# Altium project ST.PrjPcb
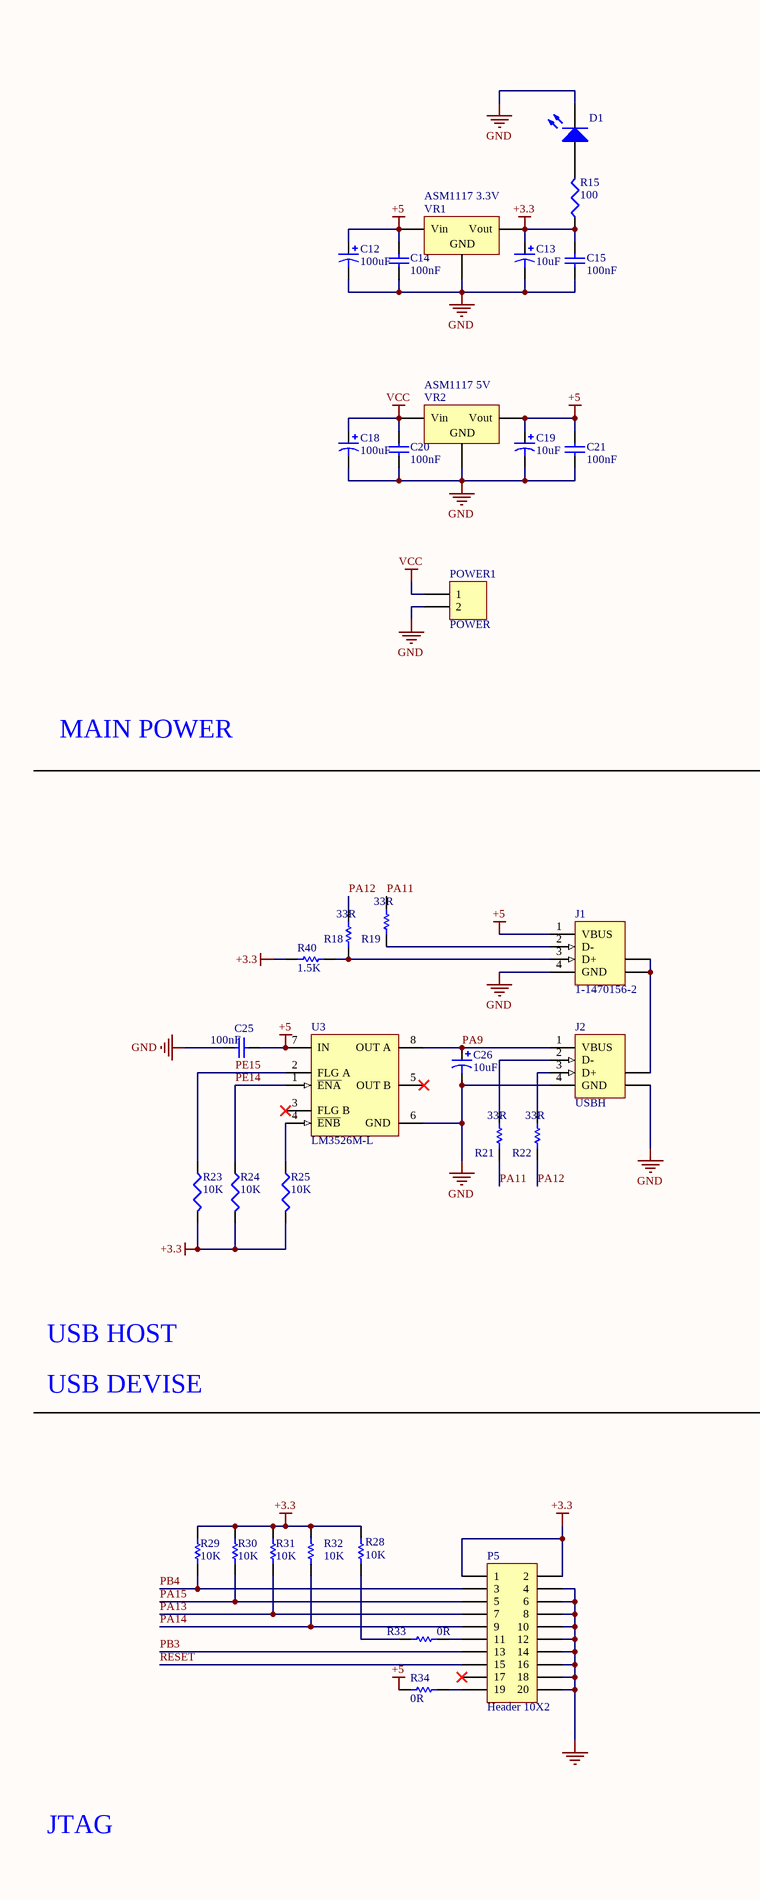
[diagram p0: mainBoard.SchDoc, left]
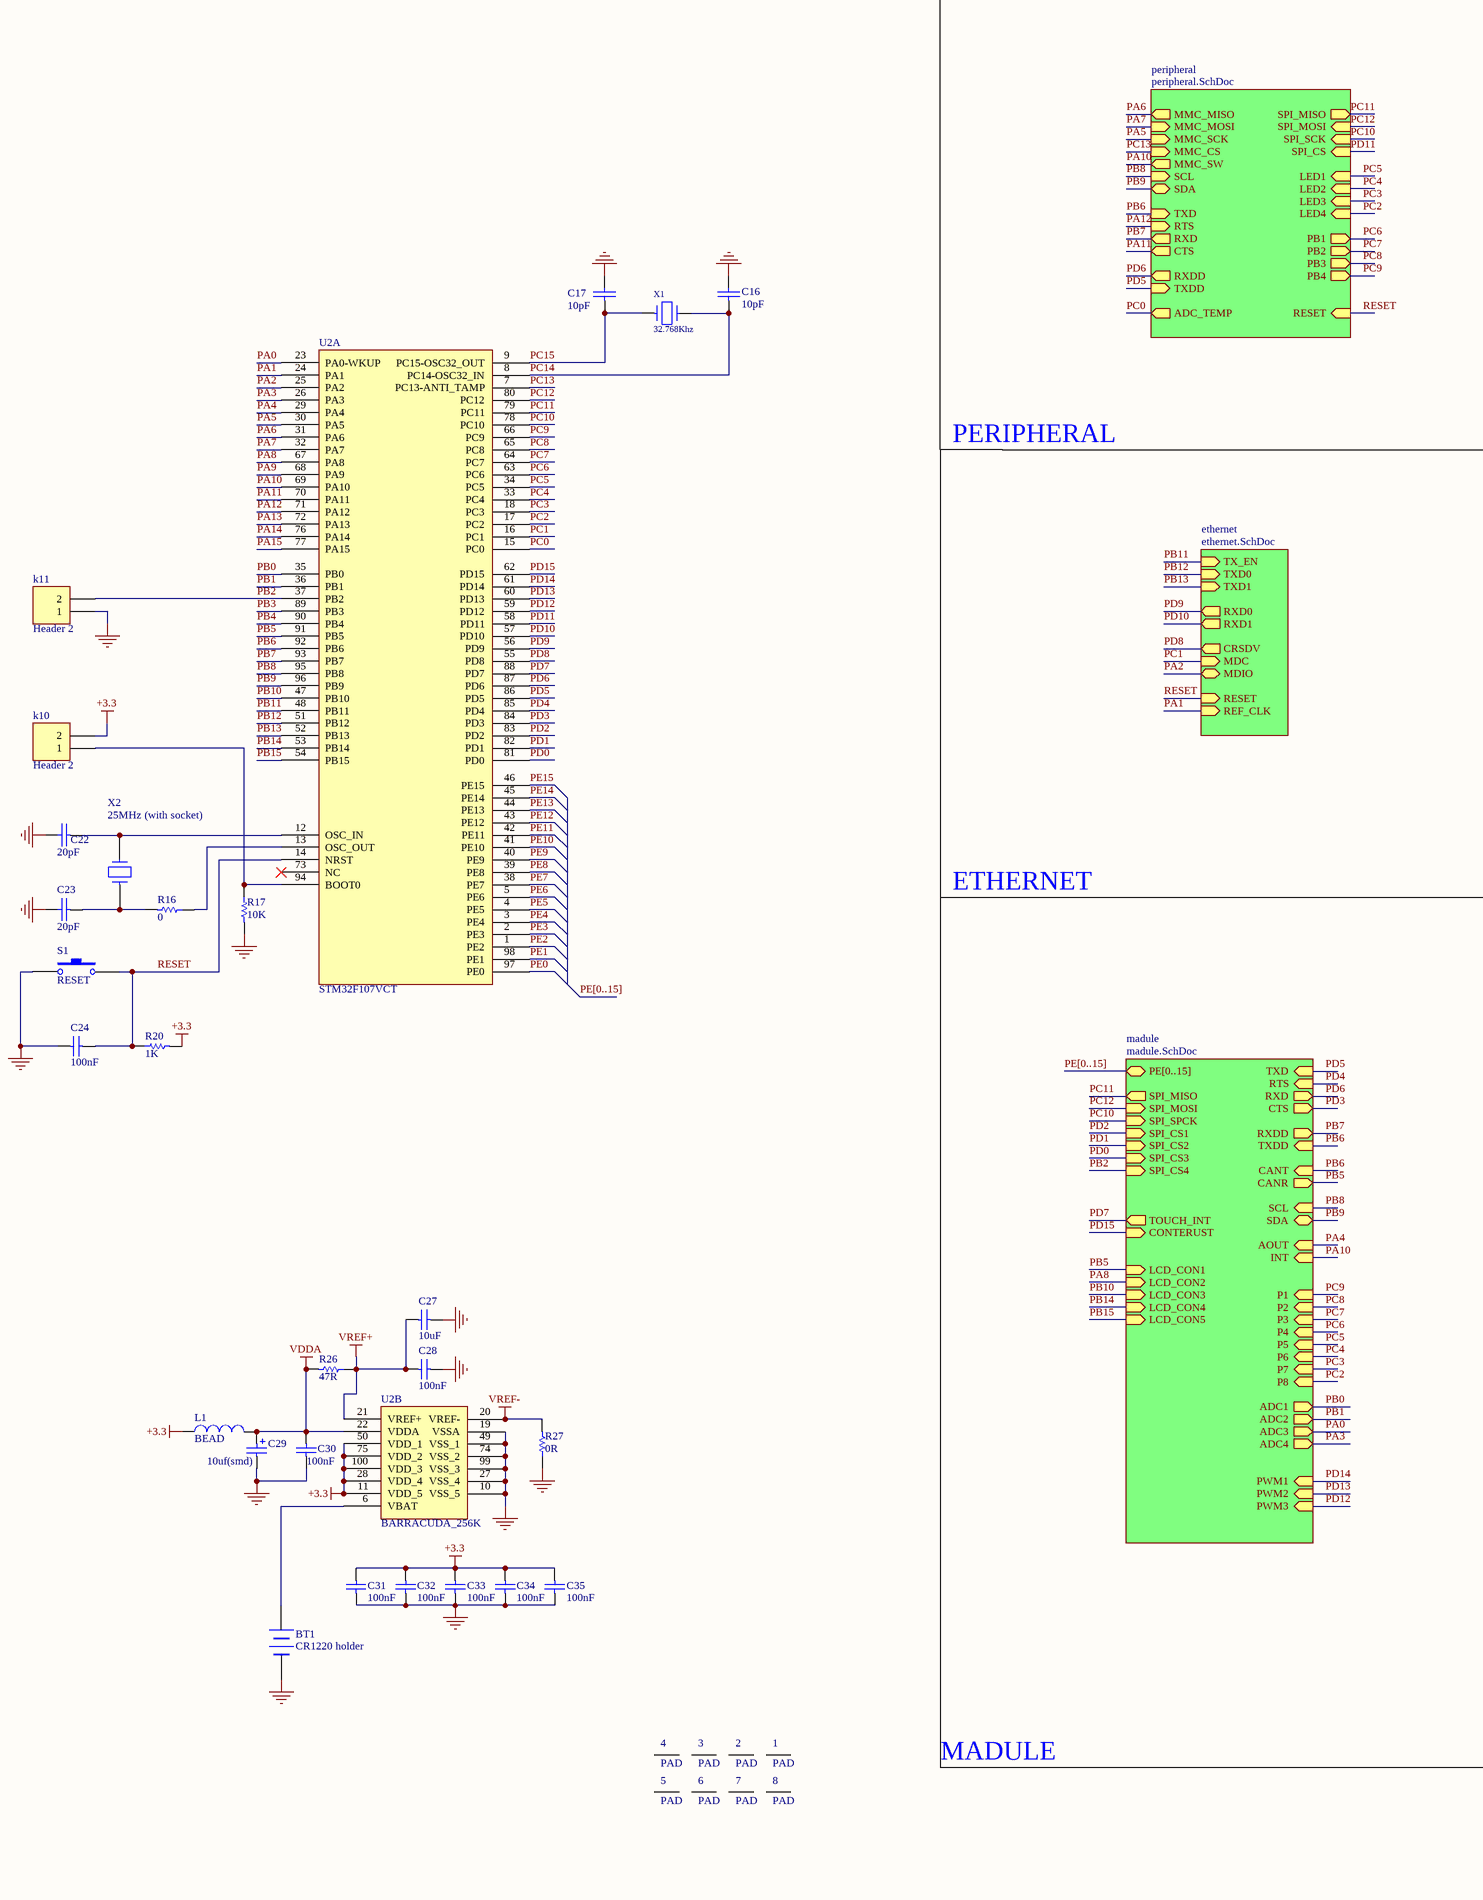
[diagram p1: mainBoard.SchDoc, right]
4 sheets, 143 parts. Net scope: hierarchical (ports join the sheet entries above them; power ports are global).
Board file: 94KA02-V1.PcbDoc
Sheets:
  mainBoard.SchDoc
    peripheral = peripheral.SchDoc
    ethernet = ethernet.SchDoc
    madule = madule.SchDoc

## Sheet mainBoard.SchDoc
size A2

### Parts
1  PAD  [pad]
2  PAD  [pad]
3  PAD  [pad]
4  PAD  [pad]
5  PAD  [pad]
6  PAD  [pad]
7  PAD  [pad]
8  PAD  [pad]
BT1  CR1220 holder  [BAT]
C12  100uf  [CAP470]
C13  10uf  [CAP10]
C14  100nF  [1206]
C15  100nF  [1206]
C16  10pF  [1206]
C17  10pF  [1206]
C18  100uf  [CAP470]
C19  10uf  [CAP10]
C20  100nF  [1206]
C21  100nF  [1206]
C22  20pF  [1206]
C23  20pF  [1206]
C24  100nF  [1206]
C25  100nF  [1206]
C26  10uf  [CAP10]
C27  10uF  [1206]
C28  100nF  [1206]
C29  10uf(smd)  [1206]
C30  100nF  [1206]
C31  100nF  [0805]
C32  100nF  [0805]
C33  100nF  [0805]
C34  100nF  [0805]
C35  100nF  [0805]
D1  LED0  [LED-0805]  (value not drawn)
J1  1-1470156-2  [440247]
J2  USBH  [787761]
k10  Header 2  [HDR1X2]
k11  Header 2  [HDR1X2]
L1  BEAD  [1206]
P5  Header 10X2  [IDC20S]
POWER1  POWER  [power jack]
R15  100  [1206]
R16  0  [1206]
R17  10K  [1206]
R18  33R  [1206]
R19  33R  [1206]
R20  1K  [1206]
R21  33R  [1206]
R22  33R  [1206]
R23  10K  [1206]
R24  10K  [1206]
R25  10K  [1206]
R26  47R  [1206]
R27  0R  [1206]
R28  10K  [1206]
R29  10K  [1206]
R30  10K  [1206]
R31  10K  [1206]
R32  10K  [1206]
R33  0R  [1206]
R34  0R  [1206]
R40  1.5K  [1206]
S1  RESET  [SWSMD]
U2  STM32F107VCT  [TQ100_TOOL]  (parts A,B of 2)
U3  LM3526M-L  [M08A_N]
VR1  ASM1117 3.3V  [Regolator]
VR2  ASM1117 5V  [Regolator]
X1  32.768Khz  [OSCILATOR]
X2  25MHz (with socket)  [XTAL3]

### Sub-sheets
ethernet = ethernet.SchDoc: TX_EN (in), TXD0 (in), TXD1 (in), RXD0 (out), RXD1 (out), CRSDV (out), MDC (in), MDIO (bidir), RESET (in), REF_CLK (in)
madule = madule.SchDoc: PE[0..15] (bidir), TXD (in), RTS (in), RXD (out), CTS (out), RXDD (out), TXDD (in), CANT (in), CANR (out), SCL (in), SDA (bidir), AOUT (in), INT (in), SPI_MOSI (in), SPI_MISO (out), SPI_SPCK (in), SPI_CS1 (in), SPI_CS2 (in), SPI_CS3 (in), SPI_CS4 (in), P1 (in), P2 (in), P3 (in), P4 (in), P5 (in), P6 (in), P7 (in), P8 (in), ADC1 (out), ADC2 (out), ADC3 (out), ADC4 (out), PWM1 (in), PWM2 (in), PWM3 (in), TOUCH_INT (out), CONTERUST (in), LCD_CON1 (in), LCD_CON2 (in), LCD_CON3 (in), LCD_CON4 (in), LCD_CON5 (in)
peripheral = peripheral.SchDoc: MMC_MISO (out), MMC_MOSI (in), MMC_SCK (in), MMC_CS (in), SCL (in), SDA (bidir), TXD (in), RTS (in), RXD (out), CTS (out), RXDD (out), TXDD (in), SPI_MISO (out), SPI_MOSI (in), SPI_SCK (in), SPI_CS (in), LED1 (in), LED2 (in), LED3 (in), LED4 (in), PB1 (out), PB2 (out), PB3 (out), PB4 (out), RESET (in), ADC_TEMP (out), MMC_SW (out)

### Nets
+3.3: C13.1 C15.1 C31.1 C32.1 C33.1 C34.1 C35.1 k10.2 L1.1 P5.1 P5.2 R15.1 R20.2 R23.2 R24.2 R25.2 R28.2 R29.2 R30.2 R31.2 R32.2 R40.1 U2.11(VDD_5) U2.28(VDD_4) U2.50(VDD_1) U2.75(VDD_2) U2.100(VDD_3) VR1.4(Vout)
+5: C12.1 C14.1 C19.1 C21.1 C25.1 J1.1(VBUS) R34.2 U3.7(IN) VR1.3(Vin) VR2.4(Vout)
GND: BT1.2(-) C12.2 C13.2 C14.2 C15.2 C16.2 C17.2 C18.2 C19.2 C20.2 C21.2 C22.2 C23.2 C24.1 C25.2 C26.2 C27.2 C28.2 C29.2 C30.2 C31.2 C32.2 C33.2 C34.2 C35.2 D1.2(K) J1.4(GND) J2.4(GND) J2.6(SHLD) k11.1 P5.4 P5.6 P5.8 P5.10 P5.12 P5.14 P5.16 P5.18 P5.20 POWER1.2 R17.2 R27.1 S1.1 U2.10(VSS_5) U2.19(VSSA) U2.27(VSS_4) U2.49(VSS_1) U2.74(VSS_2) U2.99(VSS_3) U3.6(GND) VR1.1(GND) VR2.1(GND)
VCC: C18.1 C20.1 POWER1.1 VR2.3(Vin)
VDDA: C29.1 C30.1 L1.2 R26.2 U2.22(VDDA)
VREF+: C27.1 C28.1 R26.1 U2.21(VREF+)
VREF-: R27.2 U2.20(VREF-)
PA0: U2.23(PA0-WKUP) ; sheet madule/ADC3
PA1: U2.24(PA1) ; sheet ethernet/REF_CLK  [project net 50 MHZ]
PA2: U2.25(PA2) ; sheet ethernet/MDIO
PA3: U2.26(PA3) ; sheet madule/ADC4
PA4: U2.29(PA4) ; sheet madule/AOUT
PA5: U2.30(PA5) ; sheet peripheral/MMC_SCK
PA6: U2.31(PA6) ; sheet peripheral/MMC_MISO
PA7: U2.32(PA7) ; sheet peripheral/MMC_MOSI
PA8: U2.67(PA8) ; sheet madule/LCD_CON2
PA9: C26.1 J2.1(VBUS) U2.68(PA9) U3.8(OUT_A)
PA10: U2.69(PA10) ; sheet peripheral/MMC_SW, sheet madule/INT
PA11: R19.1 R21.2 U2.70(PA11) ; sheet peripheral/CTS
PA12: R18.1 R22.2 U2.71(PA12) ; sheet peripheral/RTS
PA13: P5.7 R31.1 U2.72(PA13)
PA14: P5.9 R32.1 U2.76(PA14)
PA15: P5.5 R30.1 U2.77(PA15)
PB0: U2.35(PB0) ; sheet madule/ADC1
PB1: U2.36(PB1) ; sheet madule/ADC2
PB2: k11.2 U2.37(PB2) ; sheet madule/SPI_CS4
PB3: P5.13 U2.89(PB3)
PB4: P5.3 R29.1 U2.90(PB4)
PB5: U2.91(PB5) ; sheet madule/CANR, sheet madule/LCD_CON1
PB6: U2.92(PB6) ; sheet peripheral/TXD, sheet madule/TXDD, sheet madule/CANT
PB7: U2.93(PB7) ; sheet peripheral/RXD, sheet madule/RXDD
PB8: U2.95(PB8) ; sheet peripheral/SCL, sheet madule/SCL
PB9: U2.96(PB9) ; sheet peripheral/SDA, sheet madule/SDA
PB10: U2.47(PB10) ; sheet madule/LCD_CON3
PB11: U2.48(PB11) ; sheet ethernet/TX_EN
PB12: U2.51(PB12) ; sheet ethernet/TXD0
PB13: U2.52(PB13) ; sheet ethernet/TXD1
PB14: U2.53(PB14) ; sheet madule/LCD_CON4
PB15: U2.54(PB15) ; sheet madule/LCD_CON5
PC0: U2.15(PC0) ; sheet peripheral/ADC_TEMP
PC1: U2.16(PC1) ; sheet ethernet/MDC
PC2: U2.17(PC2) ; sheet peripheral/LED4, sheet madule/P8
PC3: U2.18(PC3) ; sheet peripheral/LED3, sheet madule/P7
PC4: U2.33(PC4) ; sheet peripheral/LED2, sheet madule/P6
PC5: U2.34(PC5) ; sheet peripheral/LED1, sheet madule/P5
PC6: U2.63(PC6) ; sheet peripheral/PB1, sheet madule/P4
PC7: U2.64(PC7) ; sheet peripheral/PB2, sheet madule/P3
PC8: U2.65(PC8) ; sheet peripheral/PB3, sheet madule/P2
PC9: U2.66(PC9) ; sheet peripheral/PB4, sheet madule/P1
PC10: U2.78(PC10) ; sheet peripheral/SPI_SCK, sheet madule/SPI_SPCK
PC11: U2.79(PC11) ; sheet peripheral/SPI_MISO, sheet madule/SPI_MISO
PC12: U2.80(PC12) ; sheet peripheral/SPI_MOSI, sheet madule/SPI_MOSI
PC13: U2.7(PC13-ANTI_TAMP) ; sheet peripheral/MMC_CS
PC14: C16.1 U2.8(PC14-OSC32_IN) X1.2
PC15: C17.1 U2.9(PC15-OSC32_OUT) X1.1
PD0: U2.81(PD0) ; sheet madule/SPI_CS3
PD1: U2.82(PD1) ; sheet madule/SPI_CS2
PD2: U2.83(PD2) ; sheet madule/SPI_CS1
PD3: U2.84(PD3) ; sheet madule/CTS
PD4: U2.85(PD4) ; sheet madule/RTS
PD5: U2.86(PD5) ; sheet peripheral/TXDD, sheet madule/TXD
PD6: U2.87(PD6) ; sheet peripheral/RXDD, sheet madule/RXD
PD7: U2.88(PD7) ; sheet madule/TOUCH_INT
PD8: U2.55(PD8) ; sheet ethernet/CRSDV
PD9: U2.56(PD9) ; sheet ethernet/RXD0
PD10: U2.57(PD10) ; sheet ethernet/RXD1
PD11: U2.58(PD11) ; sheet peripheral/SPI_CS
PD12: U2.59(PD12) ; sheet madule/PWM3
PD13: U2.60(PD13) ; sheet madule/PWM2
PD14: U2.61(PD14) ; sheet madule/PWM1
PD15: U2.62(PD15) ; sheet madule/CONTERUST
PE0: U2.97(PE0)
PE1: U2.98(PE1)
PE2: U2.1(PE2)
PE3: U2.2(PE3)
PE4: U2.3(PE4)
PE5: U2.4(PE5)
PE6: U2.5(PE6)
PE7: U2.38(PE7)
PE8: U2.39(PE8)
PE9: U2.40(PE9)
PE10: U2.41(PE10)
PE11: U2.42(PE11)
PE12: U2.43(PE12)
PE13: U2.44(PE13)
PE14: R24.1 U2.45(PE14) U3.1(~{ENA})
PE15: R23.1 U2.46(PE15) U3.2(FLG_A)
RESET: C24.2 P5.15 R20.1 S1.2 U2.14(NRST) ; sheet peripheral/RESET, sheet ethernet/RESET
NetBT1_1: BT1.1(+) U2.6(VBAT)
NetC22_1: C22.1 U2.12(OSC_IN) X2.2
NetC23_1: C23.1 R16.2 X2.1
NetD1_1: D1.1(A) R15.2
NetJ1_2: J1.2(D-) R19.2
NetJ1_3: J1.3(D+) R18.2 R40.2
NetJ1_5: J1.5(SHLD) J1.6(SHLD) J2.5(SHLD)
NetJ2_2: J2.2(D-) R21.1
NetJ2_3: J2.3(D+) R22.1
Netk10_1: k10.1 R17.1 U2.94(BOOT0)
NetP5_11: P5.11 R33.1
NetP5_19: P5.19 R34.1
NetR16_1: R16.1 U2.13(OSC_OUT)
NetR25_1: R25.1 U3.4(~{ENB})
NetR28_1: R28.1 R33.2

Not connected (* = marked no-connect by the designer): 1 1; 2 1; 3 1; 4 1; 5 1; 6 1; 7 1; 8 1; P5 17*; U2 73(NC)*; U3 3(FLG_B)* 5(OUT_B)*

### Buses and harness runs
bus PE[0..15]
bus PE[0..15] = sheet madule/PE[0..15]

### Notes on the sheet
- PERIPHERAL
- MAIN POWER
- ETHERNET
- USB HOST
- USB DEVISE
- MADULE
- JTAG

### Library data of the parts
BT1 = BATTERY
C12 C13 C18 C19 C26 C29 = Cap Pol1: Polarized Capacitor (Radial); Published: 8-Jun-2000; Publisher: Altium Limited
  C12 C18: LatestRevisionDate: 17-Jul-2002; LatestRevisionNote: Re-released for DXP Platform.; PackageReference: RB7.6-15; Value: 100uF
  C13 C19 C26: LatestRevisionDate: 17-Jul-2002; LatestRevisionNote: Re-released for DXP Platform.; PackageReference: RB7.6-15; Value: 10uF
  C29: Revision: July-2002: Re-released for DXP Platform.; Value: 10uF
C14 C15 C20 C21 = Cap Semi: Capacitor (Semiconductor SIM Model); Published: 8-Jun-2000; LatestRevisionDate: 29-May-2009; LatestRevisionNote: IPC-7351 Footprint Added.; PackageReference: 0603C; Publisher: Altium Limited; PackageDescription: Chip Capacitor; Value: 100nF
C16 C17 C22 C23 = CAP: Capacitor
C24 = CAP: Capacitor; Value: 100pF; Published: 8-Jun-2000; Revision: July-2002: Re-released for DXP Platform.; Publisher: Altium Limited
C25 = Cap: Capacitor; Published: 8-Jun-2000; LatestRevisionDate: 17-Jul-2002; LatestRevisionNote: Re-released for DXP Platform.; PackageReference: RAD-0.3; Publisher: Altium Limited; PackageDescription: Radial Cap, Thru-Hole; 2 Leads; 0.3 in Pin Spacing; Value: 100nF
C27 C28 C30-C35 = Cap: Capacitor; Value: 10nF; Published: 8-Jun-2000; Revision: July-2002: Re-released for DXP Platform.; Publisher: Altium Limited
D1 = LED0: Typical INFRARED GaAs LED; Published: 8-Jun-2000; LatestRevisionDate: 08-Jul-2005; LatestRevisionNote: Mech Layer 1 removed.; PackageReference: LED-0; Publisher: Altium Limited
J1 = 1-1470156-2: USB 1.1, Right Angle, Thru-Hole, B Type, Receptacle, 4 Position, Black; ContactMaterial: Phosphor Bronze; ContactPlating: Gold over Nickel; TerminationLength: 3.00mm [0.118in.]; PCB_Layout: Complies with manufacturer's recommendation.; DrillSize: Corresponds to nominal value.; PanelGround: Without; Published: 15-Jul-2004; DatasheetDocument: 02-Jun-2001; PackageDocument: 02-Jun-2001; PackageReference: 1-1470156; Publisher: Altium Limited; HousingMaterial: Glass-Filled Thermoplastic; ComponentLink1Description: Manufacturer Link; ComponentLink1URL: http://www.tycoelectronics.com/; ComponentLink2Description: Packaging Specification; ComponentLink2URL: http://ecommas.tycoelectronics.com/commerce/DocumentDelivery/DDEController?Action=showdoc&DocId=Customer+Drawing%7F1470156%7FO%7Ftif%7FEnglish%7FC_1470156_O.tif
J2 = 787761-3: USB 1.1, Right Angle, Thru-Hole, A Type, Receptacle, 4 Position, Natural; ContactMaterial: Copper Alloy; ContactPlating: Gold Flash over Palladium Nickel or Gold (30) over Nickel; TerminationLength: 2.84mm [0.112in.]; PCB_Layout: Complies with manufacturer's recommendation.; DrillSize: Corresponds to nominal value.; PanelGround: Without; Published: 15-Jul-2004; DatasheetDocument: 11-Jan-2004; PackageDocument: 11-Jan-2004; PackageReference: 787761; Publisher: Altium Limited; HousingMaterial: Thermoplastic; ComponentLink1Description: Manufacturer Link; ComponentLink1URL: http://www.tycoelectronics.com/; ComponentLink2Description: Packaging Specification; ComponentLink2URL: http://ecommas.tycoelectronics.com/commerce/DocumentDelivery/DDEController?Action=showdoc&DocId=Customer+Drawing%7F787761%7FH%7Ftif%7FEnglish%7FENG_CD_787761_H.tif
k10 k11 = Header 2: Header, 2-Pin; LatestRevisionDate: 17-Jul-2002; LatestRevisionNote: Re-released for DXP Platform.; Publisher: Altium Limited
L1 = Inductor: Value: 100uH; Published: 8-Jun-2000; Revision: July-2002: Re-released for DXP Platform.; Publisher: Altium Limited
P5 = Header 10X2: Header, 10-Pin, Dual row; LatestRevisionDate: 17-Jul-2002; LatestRevisionNote: Re-released for DXP Platform.; Publisher: Altium Limited
POWER1 = Header 2H: Header, 2-Pin, Right Angle; LatestRevisionDate: 17-Jul-2002; LatestRevisionNote: Re-released for DXP Platform.; Publisher: Altium Limited
R15 = Res3: Resistor; Published: 8-Jun-2000; LatestRevisionDate: 29-May-2009; LatestRevisionNote: IPC-7351 Footprint Added.; PackageReference: J1-0603; Publisher: Altium Limited; PackageDescription: Chip Resistor; Value: 100
R16 R26-R34 = Res1: Resistor; Value: 1K; Published: 8-Jun-2000; Revision: July-2002: Re-released for DXP Platform.; Publisher: Altium Limited
R17 = res1: Resistor; Value: 1K; Published: 8-Jun-2000; Revision: July-2002: Re-released for DXP Platform.; Publisher: Altium Limited
R18 R19 R21 R22 R40 = Res1: Resistor; Value: 10K; Published: 8-Jun-2000; LatestRevisionDate: 17-Jul-2002; LatestRevisionNote: Re-released for DXP Platform.; PackageReference: AXIAL-0.3; Publisher: Altium Limited; PackageDescription: Axial Device, Thru-Hole; 2 Leads; 0.3 in Pin Spacing
R20 = res1: Resistor; Published: 8-Jun-2000; Revision: July-2002: Re-released for DXP Platform.; Publisher: Altium Limited; Value: 1K
R23-R25 = RES1
S1 = SW-PB: Switch; Published: 24-Mar-1999; LatestRevisionDate: 17-Jul-2002; LatestRevisionNote: Re-released for DXP Platform.; PackageReference: SPST-2; Publisher: Altium Limited
U2 = BARRACUDA_256K
U3 = LM3526M-L: Dual Port USB Power Switch and Over-Current Protection; Manufacturer: National Semiconductor; CompType: MiscPower; PackageTopMarking: NSZXTT*3526*M-L; PowerWise: N; Published: 4-Dec-2008; DatasheetVersion: Mar-2005; PackageVersion: revL, Sep-2006; PackageReference: M08A; Publisher: Altium Limited; PackageDescription: SOIC Narrow, 4.9 x 3.9 x 1.45mm, 8 Lead, 1.27mm Pitch; PartNumber: LM3526M-L; RoHS: O; PinCount: 8; DigiKeyPartNumber: LM3526M-L-ND; Code_JEDEC: MS-012-AA; Code_IPC: SOIC127P600-8; ComponentLink1Description: LM3526 Datasheet; ComponentLink1URL: http://www.national.com/ds/LM/LM3526.pdf; ComponentLink2Description: LM3526 Web Page; ComponentLink2URL: http://www.national.com/pf/LM/LM3526.html; ComponentLink3Description: M08A Package Page; ComponentLink3URL: http://www.national.com/packaging/folders/m08a.html
VR1 VR2 = Volt Reg_1: Voltage Regulator; Published: 24-Mar-1999; LatestRevisionDate: 29-May-2009; LatestRevisionNote: IPC-7351 Footprint Added.; PackageReference: D2PAK; Publisher: Altium Limited; PackageDescription: 3-Pin Transistor Outline Package 2.54 mm Pitch, 15.1 mm Lead Span
X1 = XTAL: Crystal
X2 = CRYSTAL

## Sheet peripheral.SchDoc
size C
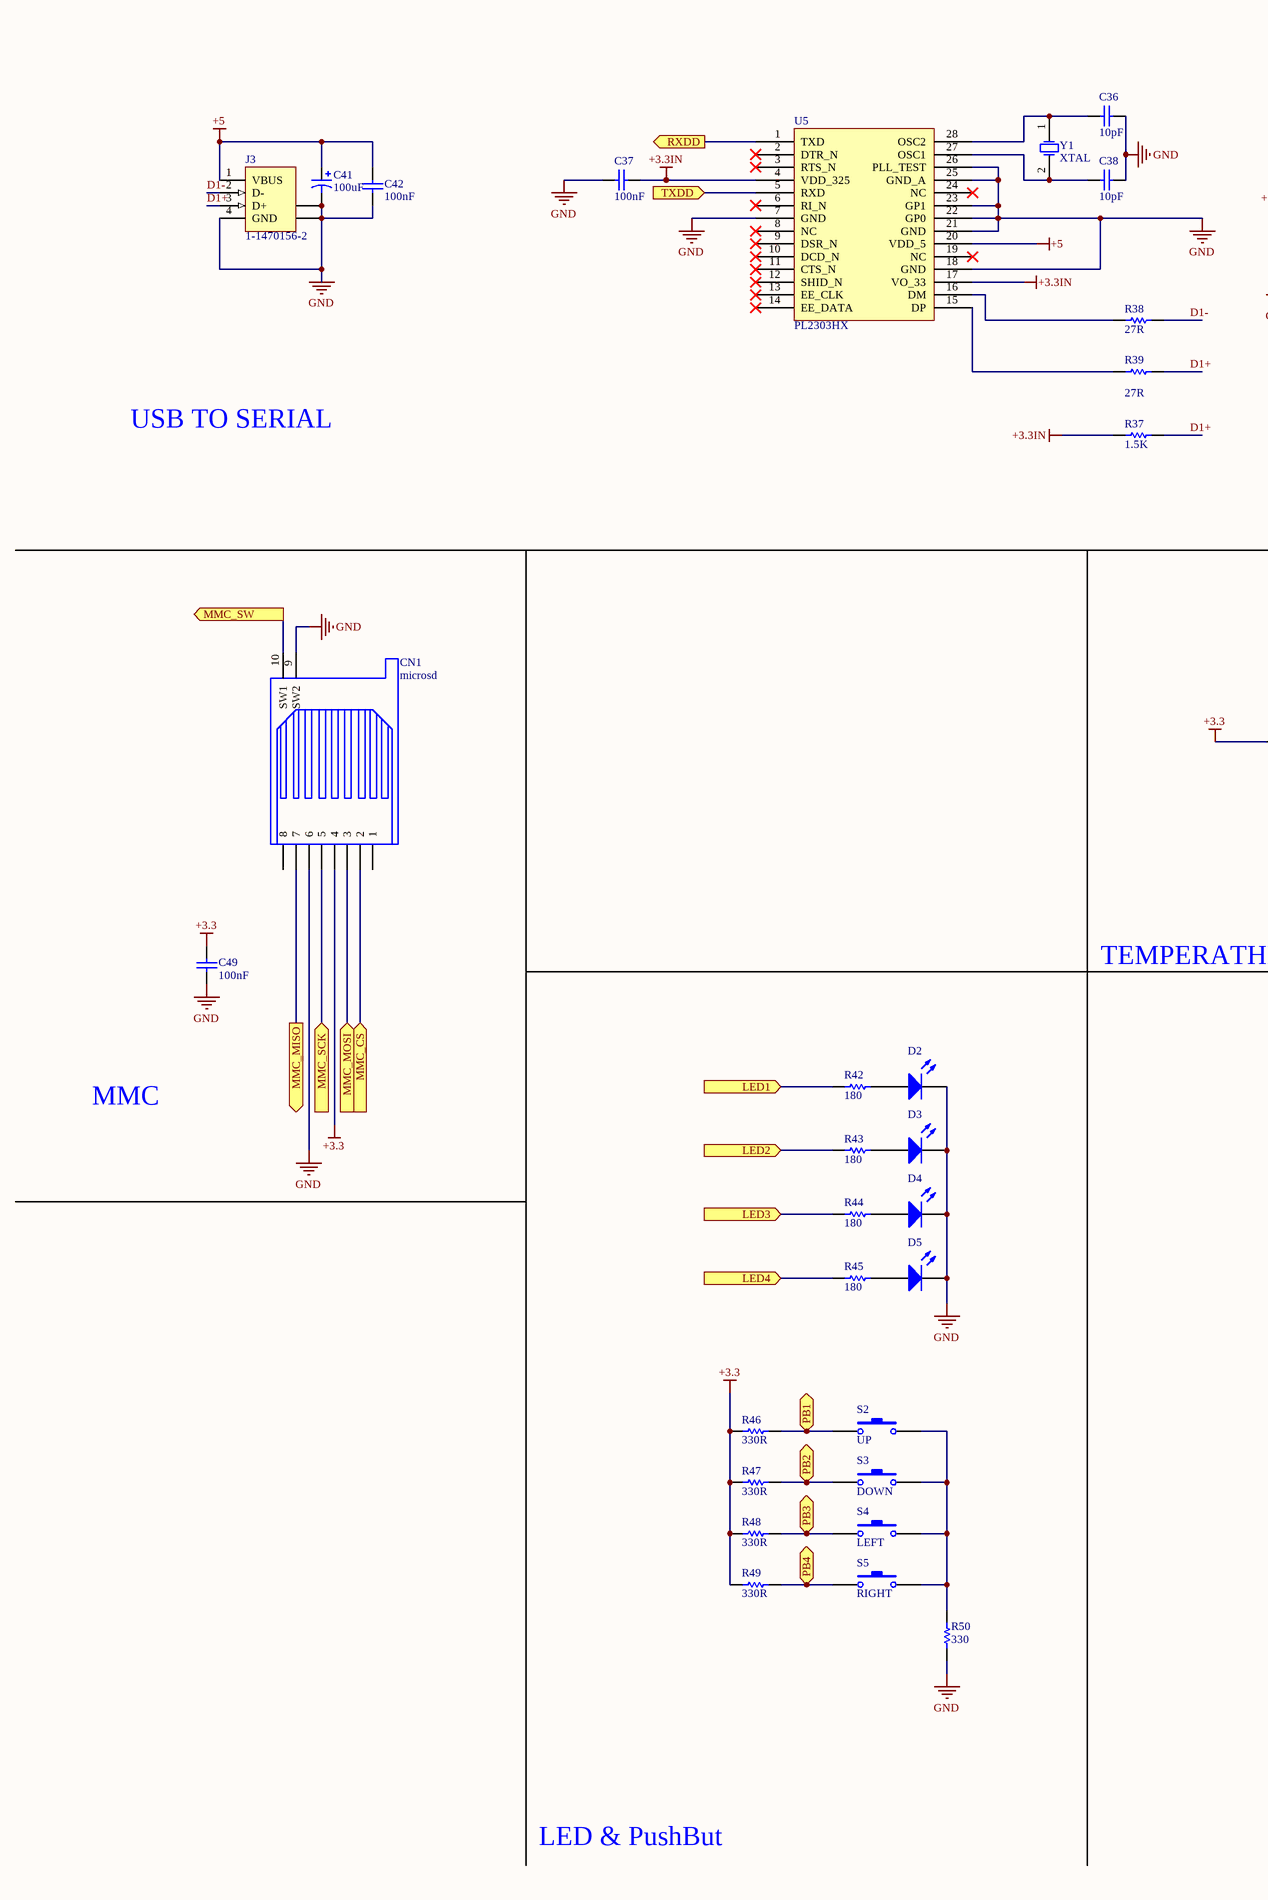
[diagram p2: peripheral.SchDoc, left]
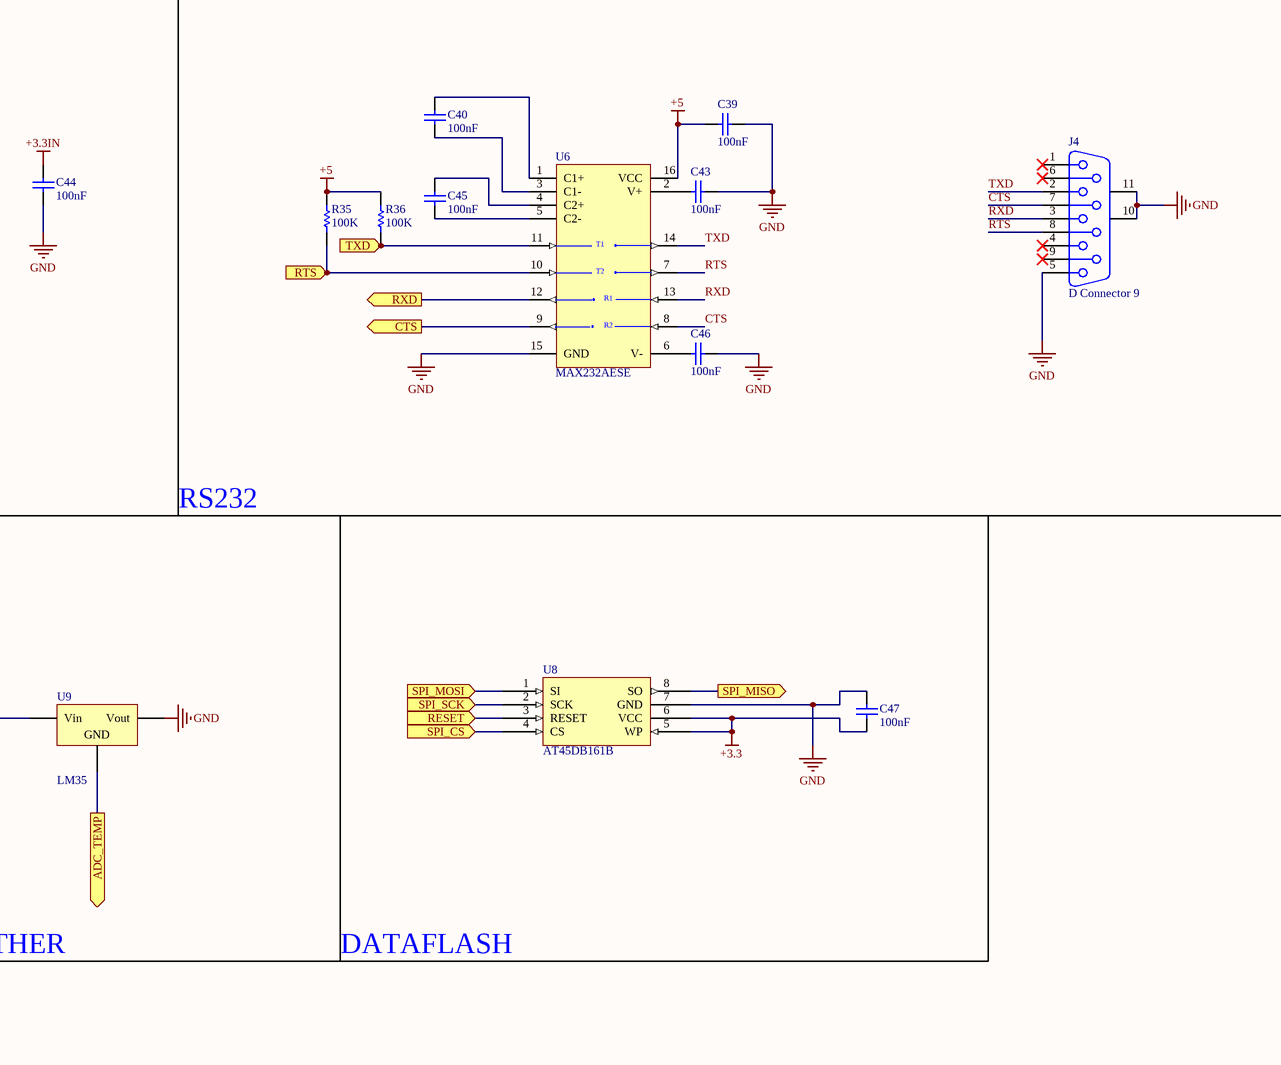
[diagram p3: peripheral.SchDoc, right]

### Parts
C36  10pF  [1206]
C37  100nF  [1206]
C38  10pF  [1206]
C39  100nF  [1206]
C40  100nF  [1206]
C41  100uF  [CAP470]
C42  100nF  [1206]
C43  100nF  [1206]
C44  100nF  [1206]
C45  100nF  [1206]
C46  100nF  [1206]
C47  100nF  [1206]
C49  100nF  [1206]
CN1  microsd  [MicroSD_1]
D2  LED3  [LED-1206]  (value not drawn)
D3  LED3  [LED-1206]  (value not drawn)
D4  LED3  [LED-1206]  (value not drawn)
D5  LED3  [LED-1206]  (value not drawn)
J3  1-1470156-2  [440247]
J4  D Connector 9  [DSUB1.385-2H9]
R35  100K  [1206]
R36  100K  [1206]
R37  1.5k  [1206]
R38  value 27R  [1206]  (hidden comment: 27)
R39  value 27R  [1206]  (hidden comment: 27)
R42  180  [1206]
R43  180  [1206]
R44  180  [1206]
R45  180  [1206]
R46  330R  [1206]
R47  330R  [1206]
R48  330R  [1206]
R49  330R  [1206]
R50  330  [1206]
S2  UP  [SWSMD]
S3  DOWN  [SWSMD]
S4  LEFT  [SWSMD]
S5  RIGHT  [SWSMD]
U5  PL2303HX  [SSOP-SS28_M]
U6  MAX232AESE  [NSO16_N]
U8  AT45DB161B  [SOP8]
U9  LM35  [to-92]
Y1  XTAL  [XTAL3]

### Ports
ADC_TEMP (out), CTS (out), LED1 (in), LED2 (in), LED3 (in), LED4 (in), MMC_CS (in), MMC_MISO (out), MMC_MOSI (in), MMC_SCK (in), MMC_SW (out), PB1 (out), PB2 (out), PB3 (out), PB4 (out), RESET (in), RTS (in), RXD (out), RXDD (out), SPI_CS (in), SPI_MISO (out), SPI_MOSI (in), SPI_SCK (in), TXD (in), TXDD (in)

### Nets
+3.3: C47.1 C49.2 CN1.4 R46.2 R47.2 R48.2 R49.2 U8.5(WP) U8.6(VCC) U9.1(Vin)
+3.3IN: C37.2 C44.2 R37.2 U5.4(VDD_325) U5.17(VO_33)
+5: C39.2 C41.1 C42.2 J3.1(VBUS) R35.1 R36.1 U5.20(VDD_5) U6.16(VCC)
GND: C36.1 C37.1 C38.1 C39.1 C41.2 C42.1 C43.1 C44.1 C46.1 C47.2 C49.1 CN1.6 CN1.9(SW2) D2.2(K) D3.2(K) D4.2(K) D5.2(K) J3.4(GND) J3.5(SHLD) J3.6(SHLD) J4.5 J4.10(MH1) J4.11(MH2) R50.1 U5.7(GND) U5.18(GND) U5.21(GND) U5.22(GP0) U5.23(GP1) U5.25(GND_A) U5.26(PLL_TEST) U6.15(GND) U8.7(GND) U9.3(Vout)
CTS: J4.7 U6.8(R2IN)
D1+: J3.3(D+) R37.1 R39.2
D1-: J3.2(D-) R38.1
PA5: CN1.5 ; port MMC_SCK
PA6: CN1.7 ; port MMC_MISO
PA7: CN1.3 ; port MMC_MOSI
PA10: CN1.10(SW1) ; port MMC_SW
PA11: U6.9(R2OUT) ; port CTS
PA12: R35.2 U6.10(T2IN) ; port RTS
PB6: R36.2 U6.11(T1IN) ; port TXD
PB7: U6.12(R1OUT) ; port RXD
PC0: U9.2(GND) ; port ADC_TEMP
PC2: R45.1 ; port LED4
PC3: R44.1 ; port LED3
PC4: R43.1 ; port LED2
PC5: R42.1 ; port LED1
PC6: R46.1 S2.1 ; port PB1
PC7: R47.1 S3.1 ; port PB2
PC8: R48.1 S4.1 ; port PB3
PC9: R49.1 S5.1 ; port PB4
PC10: U8.2(SCK) ; port SPI_SCK
PC11: U8.8(SO) ; port SPI_MISO
PC12: U8.1(SI) ; port SPI_MOSI
PC13: CN1.2 ; port MMC_CS
PD5: U5.5(RXD) ; port TXDD
PD6: U5.1(TXD) ; port RXDD
PD11: U8.4(CS) ; port SPI_CS
RESET: U8.3(RESET) ; port RESET
RTS: J4.8 U6.7(T2OUT)
RXD: J4.3 U6.13(R1IN)
TXD: J4.2 U6.14(T1OUT)
NetC36_2: C36.2 U5.28(OSC2) Y1.1(OSC1)
NetC38_2: C38.2 U5.27(OSC1) Y1.2(OSC2)
NetC40_1: C40.1 U6.3(C1-)
NetC40_2: C40.2 U6.1(C1+)
NetC43_2: C43.2 U6.2(V+)
NetC45_1: C45.1 U6.5(C2-)
NetC45_2: C45.2 U6.4(C2+)
NetC46_2: C46.2 U6.6(V-)
NetD2_1: D2.1(A) R42.2
NetD3_1: D3.1(A) R43.2
NetD4_1: D4.1(A) R44.2
NetD5_1: D5.1(A) R45.2
NetR38_2: R38.2 U5.16(DM)
NetR39_1: R39.1 U5.15(DP)
NetR50_2: R50.2 S2.2 S3.2 S4.2 S5.2

Not connected (* = marked no-connect by the designer): CN1 1 8; J4 1* 4* 6* 9*; U5 2(DTR_N)* 3(RTS_N)* 6(RI_N)* 8(NC)* 9(DSR_N)* 10(DCD_N)* 11(CTS_N)* 12(SHID_N)* 13(EE_CLK)* 14(EE_DATA)* 19(NC)* 24(NC)*

### Notes on the sheet
- USB TO SERIAL
- RS232
- TEMPERATHER
- DATAFLASH
- MMC
- LED & PushBut
- (in symbol MAX232AESE) T1; T2; R1; R2

### Library data of the parts
C36-C40 C42-C47 C49 = Cap: Capacitor; Value: 100pF; Published: 8-Jun-2000; LatestRevisionDate: 17-Jul-2002; LatestRevisionNote: Re-released for DXP Platform.; PackageReference: RAD-0.3; Publisher: Altium Limited; PackageDescription: Radial Cap, Thru-Hole; 2 Leads; 0.3 in Pin Spacing
C41 = Cap Pol1: Polarized Capacitor (Radial); Published: 8-Jun-2000; LatestRevisionDate: 17-Jul-2002; LatestRevisionNote: Re-released for DXP Platform.; PackageReference: RB7.6-15; Publisher: Altium Limited; PackageDescription: Polarized Capacitor (Radial); 2 Leads; Value: 100uF
CN1 = SMS016AFA5E
D2-D5 = LED3: Typical BLUE SiC LED; Published: 8-Jun-2000; LatestRevisionDate: 17-Dec-2003; LatestRevisionNote: PCB Footprint replaced.; DatasheetVersion: 16-Apr-2002; PackageVersion: 16-Apr-2002; PackageReference: 3.5X2.8X1.9; Publisher: Altium Limited
J3 = 1-1470156-2: as J1 on sheet mainBoard; Published: 15-Jul-2004; DatasheetDocument: 02-Jun-2001; PackageDocument: 02-Jun-2001; PackageReference: 1-1470156; Publisher: Altium Limited; HousingMaterial: Glass-Filled Thermoplastic; ComponentLink1Description: Manufacturer Link; ComponentLink1URL: http://www.tycoelectronics.com/; ComponentLink2Description: Packaging Specification; ComponentLink2URL: http://ecommas.tycoelectronics.com/commerce/DocumentDelivery/DDEController?Action=showdoc&DocId=Customer+Drawing%7F1470156%7FO%7Ftif%7FEnglish%7FC_1470156_O.tif
J4 = D Connector 9: Receptacle Assembly, 9 Position, Right Angle; PackageDocument: O; Positions: 9; Published: 15-Jun-2001; LatestRevisionDate: 17-Jul-2002; LatestRevisionNote: Re-released for DXP Platform.; DatasheetDocument: 1-Sep-1999; PackageReference: 788750; Publisher: Altium Limited; Orientation: Right Angle; Gender: Receptacle
R35 R36 = Res1: Resistor; Value: 1K; Published: 8-Jun-2000; Revision: July-2002: Re-released for DXP Platform.; Publisher: Altium Limited
R37-R39 = Res1: Resistor; Published: 8-Jun-2000; LatestRevisionDate: 17-Jul-2002; LatestRevisionNote: Re-released for DXP Platform.; PackageReference: AXIAL-0.3; Publisher: Altium Limited
  R37: Value: 1.5K
R42-R50 = Res Semi: Semiconductor Resistor; Value: 27; Published: 8-Jun-2000; LatestRevisionDate: 17-Jul-2002; LatestRevisionNote: Re-released for DXP Platform.; PackageReference: AXIAL-0.5; Publisher: Altium Limited
S2-S5 = SW-PB: Switch; Published: 24-Mar-1999; LatestRevisionDate: 17-Jul-2002; LatestRevisionNote: Re-released for DXP Platform.; PackageReference: SPST-2; Publisher: Altium Limited
U5 = PL2303
U6 = MAX232AESE: +5V-Powered, Multichannel RS-232 Driver/Receiver; Published: 16-Jan-2001; LatestRevisionDate: 13-Apr-2006; LatestRevisionNote: IPC-7351 Footprint Added.; DatasheetVersion: Nov-1997; PackageReference: NSO16; Publisher: Altium Limited; PackageDescription: 16-Pin Small Outline Integrated Circuit 1.27 mm Pitch; Code_JEDEC: MS-012-AC; Code_IPC: SOIC127P600-16; ComponentLink1Description: Manufacturer Link; ComponentLink1URL: http://www.maxim-ic.com/; ComponentLink2Description: Datasheet; ComponentLink2URL: http://pdfserv.maxim-ic.com/en/ds/MAX220-MAX249.pdf
U9 = Volt Reg: Voltage Regulator; Published: 24-Mar-1999; LatestRevisionDate: 29-May-2009; LatestRevisionNote: IPC-7351 Footprint Added.; PackageReference: D2PAK; Publisher: Altium Limited; PackageDescription: 3-Pin Transistor Outline Package 2.54 mm Pitch, 15.1 mm Lead Span
Y1 = XTAL: Crystal Oscillator; Published: 8-Jun-2000; LatestRevisionDate: 17-Jul-2002; LatestRevisionNote: Re-released for DXP Platform.; PackageReference: R38; Publisher: Altium Limited; PackageDescription: Crystal, Thru-Hole; 2 Leads; Body 3.1 x 8.2 mm (Dia.xH)

## Sheet ethernet.SchDoc
size A4
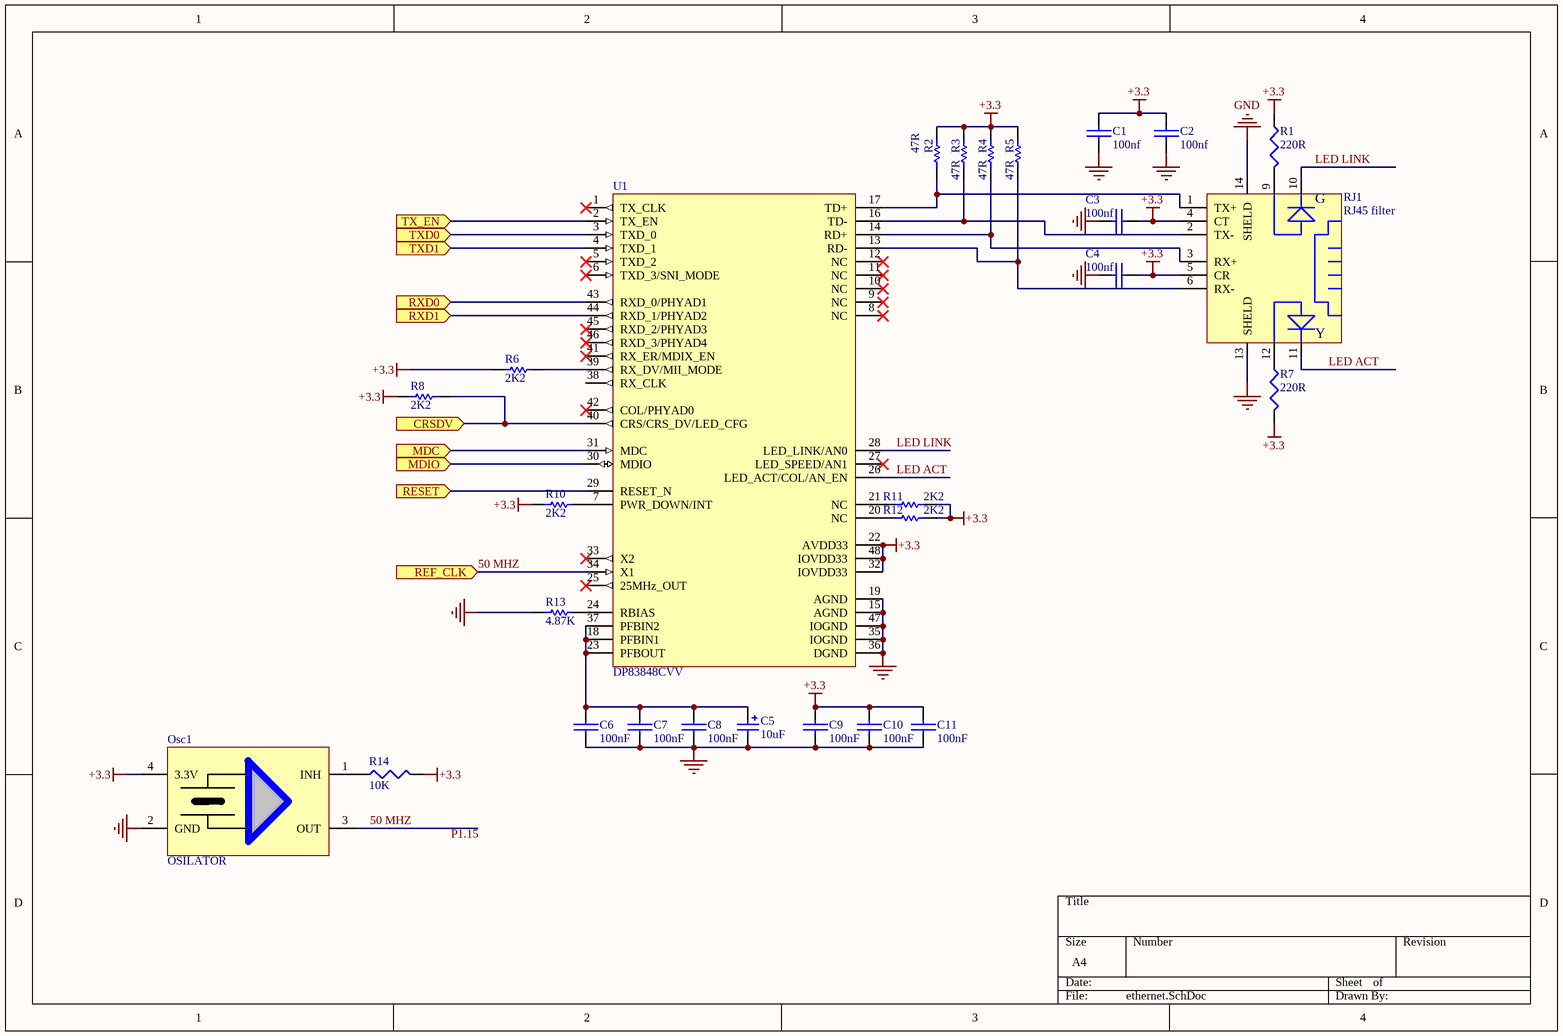
[diagram p4: ethernet.SchDoc]

### Parts
C1  100nf  [1206]
C2  100nf  [1206]
C3  100nf  [1206]
C4  100nf  [1206]
C5  10uF  [cap10]
C6  100nF  [0805]
C7  100nF  [0805]
C8  100nF  [0805]
C9  100nF  [0805]
C10  100nF  [0805]
C11  100nF  [0805]
Osc1  OSILATOR  [XTAL_5X7]
R1  220R  [1206]
R2  47R  [1206]
R3  47R  [1206]
R4  47R  [1206]
R5  47R  [1206]
R6  2K2  [1206]
R7  220R  [1206]
R8  2K2  [1206]
R10  2K2  [1206]
R11  2K2  [1206]
R12  2K2  [1206]
R13  4.87K  [1206]
R14  10K  [1206]
RJ1  RJ45 filter  [RJ45LED]
U1  DP83848CVV  [TQFP48_M]

### Ports
CRSDV (in), MDC (in), MDIO (in), REF_CLK (in), RESET (in), RXD0 (in), RXD1 (in), TX_EN (in), TXD0 (in), TXD1 (in)

### Nets
+3.3: C1.2 C2.2 C3.2 C4.2 C9.1 C10.2 C11.2 Osc1.4(3.3V) R1.1 R2.2 R3.2 R4.2 R5.2 R6.1 R7.1 R8.1 R10.1 R11.2 R12.2 R14.2 RJ1.4(CT) RJ1.5(CR) U1.22(AVDD33) U1.32(IOVDD33) U1.48(IOVDD33)
GND: C1.1 C2.1 C3.1 C4.1 C5.2 C6.2 C7.1 C8.1 C9.2 C10.1 C11.1 Osc1.2(GND) R13.1 RJ1.13(SHELD) RJ1.14(SHELD) U1.15(AGND) U1.19(AGND) U1.35(IOGND) U1.36(DGND) U1.47(IOGND)
50 MHZ: Osc1.3(OUT) U1.34(X1) ; port REF_CLK
LED ACT: RJ1.11(ledy-) U1.26(LED_ACT/COL/AN_EN)
LED LINK: RJ1.10(ledg-) U1.28(LED_LINK/AN0)
PA2: U1.30(MDIO) ; port MDIO
PB11: U1.2(TX_EN) ; port TX_EN
PB12: U1.3(TXD_0) ; port TXD0
PB13: U1.4(TXD_1) ; port TXD1
PC1: U1.31(MDC) ; port MDC
PD8: R8.2 U1.40(CRS/CRS_DV/LED_CFG) ; port CRSDV
PD9: U1.43(RXD_0/PHYAD1) ; port RXD0
PD10: U1.44(RXD_1/PHYAD2) ; port RXD1
RESET: U1.29(RESET_N) ; port RESET
NetC5_1: C5.1 C6.1 C7.2 C8.2 U1.18(PFBIN1) U1.23(PFBOUT) U1.37(PFBIN2)
NetOsc1_1: Osc1.1(INH) R14.1
NetR1_2: R1.2 RJ1.9(ledg+)
NetR2_1: R2.1 RJ1.1(TX+) U1.17(TD+)
NetR3_1: R3.1 RJ1.2(TX-) U1.16(TD-)
NetR4_1: R4.1 RJ1.3(RX+) U1.14(RD+)
NetR5_1: R5.1 RJ1.6(RX-) U1.13(RD-)
NetR6_2: R6.2 U1.39(RX_DV/MII_MODE)
NetR7_2: R7.2 RJ1.12(ledy+)
NetR10_2: R10.2 U1.7(PWR_DOWN/INT)
NetR11_1: R11.1 U1.21(NC)
NetR12_1: R12.1 U1.20(NC)
NetR13_2: R13.2 U1.24(RBIAS)

Not connected (* = marked no-connect by the designer): U1 1(TX_CLK)* 5(TXD_2)* 6(TXD_3/SNI_MODE)* 8(NC)* 9(NC)* 10(NC)* 11(NC)* 12(NC)* 25(25MHz_OUT)* 27(LED_SPEED/AN1)* 33(X2)* 38(RX_CLK) 41(RX_ER/MDIX_EN)* 42(COL/PHYAD0)* 45(RXD_2/PHYAD3)* 46(RXD_3/PHYAD4)*

### Notes on the sheet
- Labels drawn without touching a wire or pin: P1.15
- (in symbol RJ45_led_filter) G; Y

### Library data of the parts
C1-C4 = CAP
C5 = Cap Pol1: Polarized Capacitor (Radial); Published: 8-Jun-2000; Revision: July-2002: Re-released for DXP Platform.; Publisher: Altium Limited; Value: 10uF
C6-C11 = CAP: Capacitor
R1 R7 R14 = Res3: Resistor; Value: 1K; Published: 8-Jun-2000; LatestRevisionDate: 04-Mar-2005; LatestRevisionNote: PCB Footprint replaced.; PackageReference: J1-0603; Publisher: Altium Limited
R2-R6 R8 R10-R13 = Res1: Resistor; Value: 1K; Published: 8-Jun-2000; Revision: July-2002: Re-released for DXP Platform.; Publisher: Altium Limited
RJ1 = RJ45_led_filter

## Sheet madule.SchDoc
size A
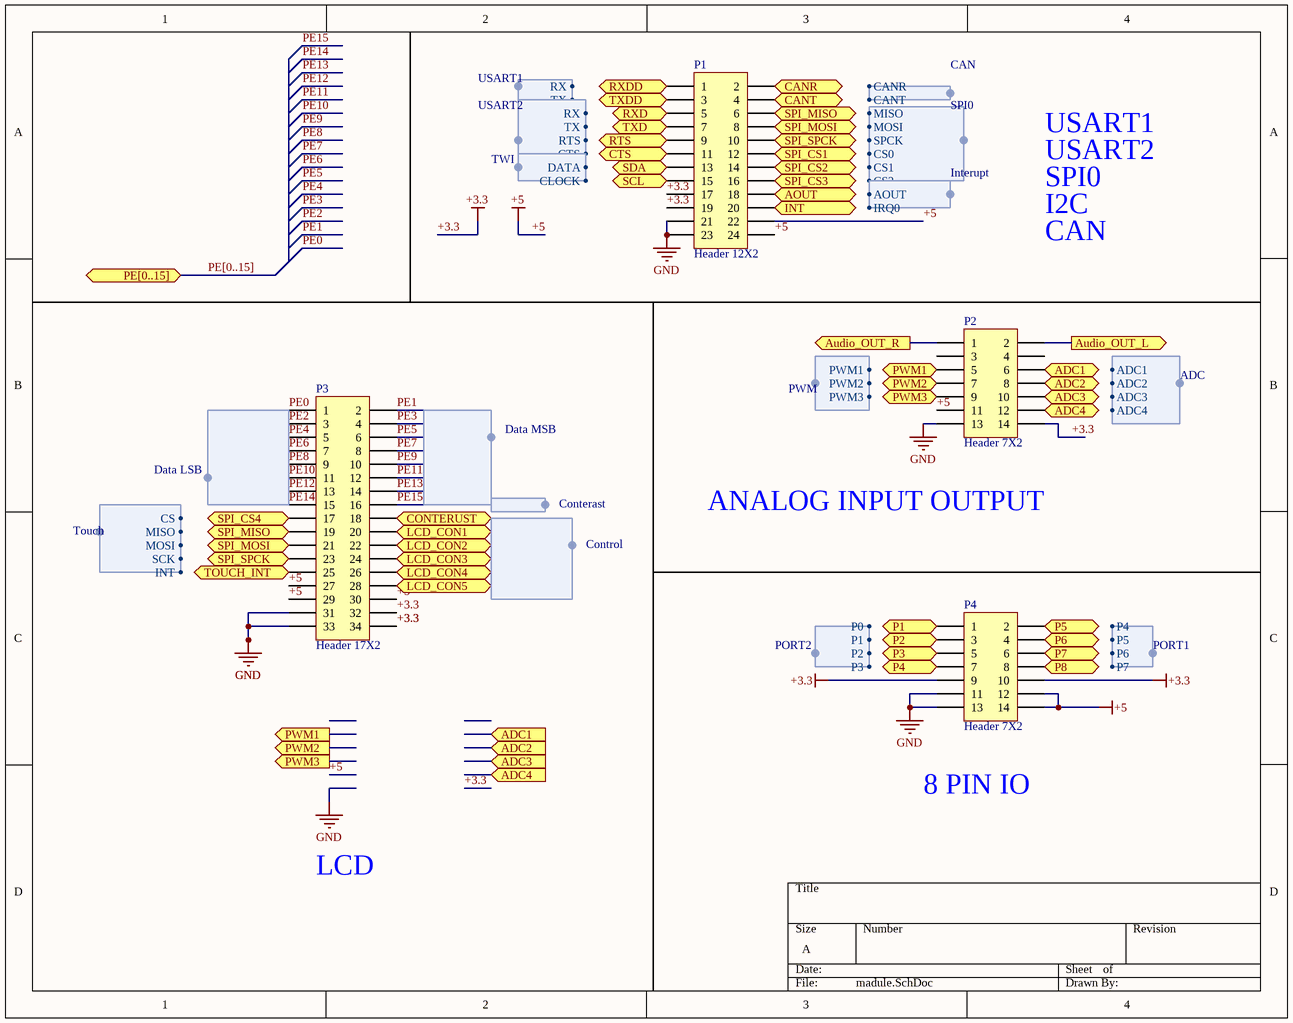
[diagram p5: madule.SchDoc]

### Parts
P1  Header 12X2  [IDC24S]
P2  Header 7X2  [IDC14S]
P3  Header 17X2  [IDC34S]
P4  Header 7X2  [IDC14S]

### Ports
ADC1 (in), ADC1 (out), ADC2 (in), ADC2 (out), ADC3 (in), ADC3 (out), ADC4 (in), ADC4 (out), AOUT (out), Audio_OUT_L (out), Audio_OUT_R (out), CANR (in), CANT (out), CONTERUST (in), CTS (in), INT (out), LCD_CON1 (in), LCD_CON2 (in), LCD_CON3 (in), LCD_CON4 (in), LCD_CON5 (in), P1 (bidir), P2 (bidir), P3 (bidir), P4 (bidir), P5 (bidir), P6 (bidir), P7 (bidir), P8 (bidir), PE[0..15] (bidir), PWM1 (in), PWM1 (out), PWM2 (in), PWM2 (out), PWM3 (in), PWM3 (out), RTS (out), RXD (out), RXDD (in), SCL (in), SDA (bidir), SPI_CS1 (in), SPI_CS2 (in), SPI_CS3 (in), SPI_CS4 (in), SPI_MISO (out), SPI_MOSI (in), SPI_SPCK (in), TOUCH_INT (in), TXD (in), TXDD (out)

### Harnesses
Data LSB: 
Data MSB: 
Conterast: 
Touch: CS, MISO, MOSI, SCK, INT
Control: 
USART1: RX, TX
USART2: TX, RX, RTS, CTS
TWI: DATA, CLOCK
CAN: CANR, CANT
SPI0: MISO, MOSI, SPCK, CS0, CS1, CS2
Interupt: AOUT, IRQ0
PORT2: P0, P1, P2, P3
PORT1: P4, P5, P6, P7
PWM: PWM1, PWM2, PWM3
ADC: ADC1, ADC2, ADC3, ADC4

### Nets
+3.3: P1.17 P1.19 P2.14 P3.32 P3.34 P4.9 P4.10
+5: P1.22 P1.24 P2.11 P3.27 P3.29 P3.30 P4.12 P4.14
GND: P1.21 P1.23 P2.13 P3.31 P3.33 P4.11 P4.13
PA0: P2.10 ; port ADC3
PA3: P2.12 ; port ADC4
PA4: P1.18 ; port AOUT
PA8: P3.22 ; port LCD_CON2
PA10: P1.20 ; port INT
PB0: P2.6 ; port ADC1
PB1: P2.8 ; port ADC2
PB2: P3.17 ; port SPI_CS4
PB5: P1.2 P3.20 ; port CANR, port LCD_CON1
PB6: P1.3 P1.4 ; port CANT, port TXDD
PB7: P1.1 ; port RXDD
PB8: P1.15 ; port SCL
PB9: P1.13 ; port SDA
PB10: P3.24 ; port LCD_CON3
PB14: P3.26 ; port LCD_CON4
PB15: P3.28 ; port LCD_CON5
PC2: P4.8 ; port P8
PC3: P4.6 ; port P7
PC4: P4.4 ; port P6
PC5: P4.2 ; port P5
PC6: P4.7 ; port P4
PC7: P4.5 ; port P3
PC8: P4.3 ; port P2
PC9: P4.1 ; port P1
PC10: P1.10 P3.23 ; port SPI_SPCK
PC11: P1.6 P3.19 ; port SPI_MISO
PC12: P1.8 P3.21 ; port SPI_MOSI
PD0: P1.16 ; port SPI_CS3
PD1: P1.14 ; port SPI_CS2
PD2: P1.12 ; port SPI_CS1
PD3: P1.11 ; port CTS
PD4: P1.9 ; port RTS
PD5: P1.7 ; port TXD
PD6: P1.5 ; port RXD
PD7: P3.25 ; port TOUCH_INT
PD12: P2.9 ; port PWM3
PD13: P2.7 ; port PWM2
PD14: P2.5 ; port PWM1
PD15: P3.18 ; port CONTERUST
PE0: P3.1
PE1: P3.2
PE2: P3.3
PE3: P3.4
PE4: P3.5
PE5: P3.6
PE6: P3.7
PE7: P3.8
PE8: P3.9
PE9: P3.10
PE10: P3.11
PE11: P3.12
PE12: P3.13
PE13: P3.14
PE14: P3.15
PE15: P3.16
NetP2_1: P2.1 ; port Audio_OUT_R
NetP2_2: P2.2 ; port Audio_OUT_L

Not connected (* = marked no-connect by the designer): P2 3 4

### Buses and harness runs
bus PE[0..15] = port PE[0..15]

### Notes on the sheet
- USART1
- USART2
- SPI0
- I2C
- CAN
- ANALOG INPUT OUTPUT
- 8 PIN IO
- LCD

### Library data of the parts
P1 = Header 12X2: Header, 12-Pin, Dual row; LatestRevisionDate: 17-Jul-2002; LatestRevisionNote: Re-released for DXP Platform.; Publisher: Altium Limited
P2 P4 = Header 7X2: Header, 7-Pin, Dual row; LatestRevisionDate: 17-Jul-2002; LatestRevisionNote: Re-released for DXP Platform.; Publisher: Altium Limited
P3 = Header 17X2: Header, 17-Pin, Dual row; LatestRevisionDate: 17-Jul-2002; LatestRevisionNote: Re-released for DXP Platform.; Publisher: Altium Limited

## Nets that join several sheets
+3.3: mainBoard (28 pins), peripheral (10 pins), ethernet (25 pins), madule (7 pins)
+5: mainBoard (10 pins), peripheral (8 pins), madule (8 pins)
GND: mainBoard (52 pins), peripheral (34 pins), ethernet (20 pins), madule (7 pins)
50 MHZ: mainBoard (U2.24), ethernet (Osc1.3 U1.34)
PA0: mainBoard (U2.23), madule (P2.10)
PA2: mainBoard (U2.25), ethernet (U1.30)
PA3: mainBoard (U2.26), madule (P2.12)
PA4: mainBoard (U2.29), madule (P1.18)
PA5: mainBoard (U2.30), peripheral (CN1.5)
PA6: mainBoard (U2.31), peripheral (CN1.7)
PA7: mainBoard (U2.32), peripheral (CN1.3)
PA8: mainBoard (U2.67), madule (P3.22)
PA10: mainBoard (U2.69), peripheral (CN1.10), madule (P1.20)
PA11: mainBoard (R19.1 R21.2 U2.70), peripheral (U6.9)
PA12: mainBoard (R18.1 R22.2 U2.71), peripheral (R35.2 U6.10)
PB0: mainBoard (U2.35), madule (P2.6)
PB1: mainBoard (U2.36), madule (P2.8)
PB2: mainBoard (k11.2 U2.37), madule (P3.17)
PB5: mainBoard (U2.91), madule (P1.2 P3.20)
PB6: mainBoard (U2.92), peripheral (R36.2 U6.11), madule (P1.3 P1.4)
PB7: mainBoard (U2.93), peripheral (U6.12), madule (P1.1)
PB8: mainBoard (U2.95), madule (P1.15)
PB9: mainBoard (U2.96), madule (P1.13)
PB10: mainBoard (U2.47), madule (P3.24)
PB11: mainBoard (U2.48), ethernet (U1.2)
PB12: mainBoard (U2.51), ethernet (U1.3)
PB13: mainBoard (U2.52), ethernet (U1.4)
PB14: mainBoard (U2.53), madule (P3.26)
PB15: mainBoard (U2.54), madule (P3.28)
PC0: mainBoard (U2.15), peripheral (U9.2)
PC1: mainBoard (U2.16), ethernet (U1.31)
PC2: mainBoard (U2.17), peripheral (R45.1), madule (P4.8)
PC3: mainBoard (U2.18), peripheral (R44.1), madule (P4.6)
PC4: mainBoard (U2.33), peripheral (R43.1), madule (P4.4)
PC5: mainBoard (U2.34), peripheral (R42.1), madule (P4.2)
PC6: mainBoard (U2.63), peripheral (R46.1 S2.1), madule (P4.7)
PC7: mainBoard (U2.64), peripheral (R47.1 S3.1), madule (P4.5)
PC8: mainBoard (U2.65), peripheral (R48.1 S4.1), madule (P4.3)
PC9: mainBoard (U2.66), peripheral (R49.1 S5.1), madule (P4.1)
PC10: mainBoard (U2.78), peripheral (U8.2), madule (P1.10 P3.23)
PC11: mainBoard (U2.79), peripheral (U8.8), madule (P1.6 P3.19)
PC12: mainBoard (U2.80), peripheral (U8.1), madule (P1.8 P3.21)
PC13: mainBoard (U2.7), peripheral (CN1.2)
PD0: mainBoard (U2.81), madule (P1.16)
PD1: mainBoard (U2.82), madule (P1.14)
PD2: mainBoard (U2.83), madule (P1.12)
PD3: mainBoard (U2.84), madule (P1.11)
PD4: mainBoard (U2.85), madule (P1.9)
PD5: mainBoard (U2.86), peripheral (U5.5), madule (P1.7)
PD6: mainBoard (U2.87), peripheral (U5.1), madule (P1.5)
PD7: mainBoard (U2.88), madule (P3.25)
PD8: mainBoard (U2.55), ethernet (R8.2 U1.40)
PD9: mainBoard (U2.56), ethernet (U1.43)
PD10: mainBoard (U2.57), ethernet (U1.44)
PD11: mainBoard (U2.58), peripheral (U8.4)
PD12: mainBoard (U2.59), madule (P2.9)
PD13: mainBoard (U2.60), madule (P2.7)
PD14: mainBoard (U2.61), madule (P2.5)
PD15: mainBoard (U2.62), madule (P3.18)
PE0: mainBoard (U2.97), madule (P3.1)
PE1: mainBoard (U2.98), madule (P3.2)
PE2: mainBoard (U2.1), madule (P3.3)
PE3: mainBoard (U2.2), madule (P3.4)
PE4: mainBoard (U2.3), madule (P3.5)
PE5: mainBoard (U2.4), madule (P3.6)
PE6: mainBoard (U2.5), madule (P3.7)
PE7: mainBoard (U2.38), madule (P3.8)
PE8: mainBoard (U2.39), madule (P3.9)
PE9: mainBoard (U2.40), madule (P3.10)
PE10: mainBoard (U2.41), madule (P3.11)
PE11: mainBoard (U2.42), madule (P3.12)
PE12: mainBoard (U2.43), madule (P3.13)
PE13: mainBoard (U2.44), madule (P3.14)
PE14: mainBoard (R24.1 U2.45 U3.1), madule (P3.15)
PE15: mainBoard (R23.1 U2.46 U3.2), madule (P3.16)
RESET: mainBoard (5 pins), peripheral (U8.3), ethernet (U1.29)